# Altium project TempGuard.PrjPcb (part 1 of 2)
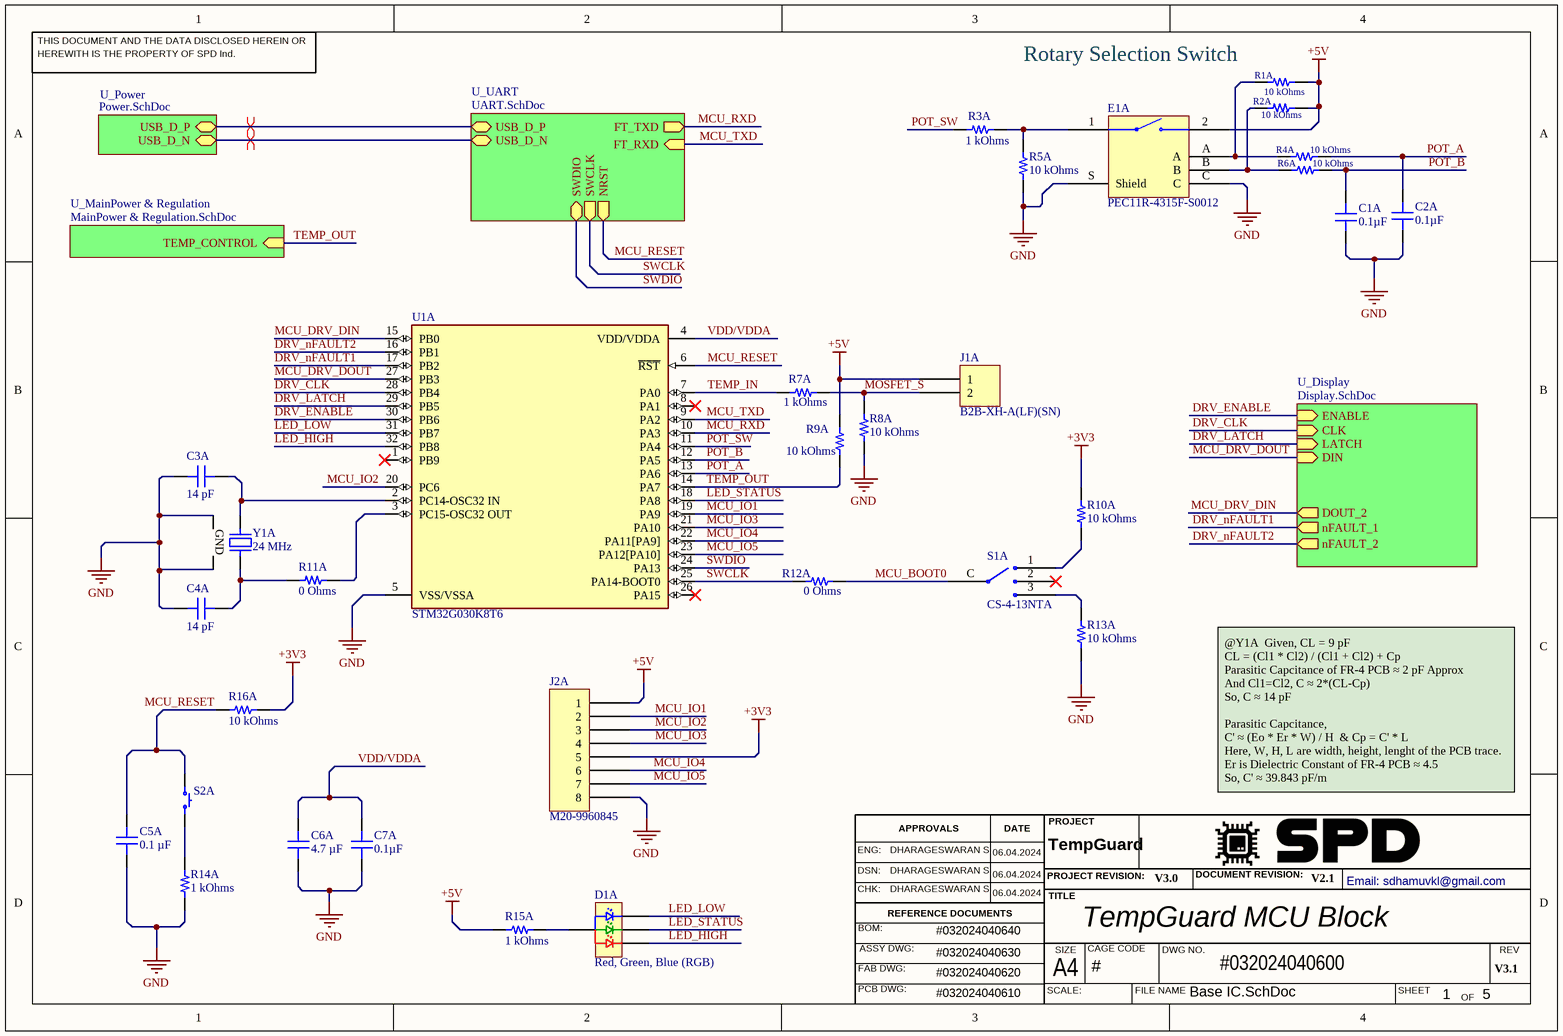
[diagram p0: Base IC.SchDoc]
CAGE_CODE: #; Date: 06.04.2024; DOC_NO_ASSY_DWG: #032024040630; DOC_NO_BOM: #032024040640; DOC_NO_FAB_DWG: #032024040620; DOC_NO_SCH_DWG: #032024040600; DocumentRevision: V2.1; PCB_DWG_NO: #032024040610; Project: TempGuard; ProjectRevision: V3.0; Revision: V3.1
5 sheets, 119 parts. Net scope: hierarchical (ports join the sheet entries above them; power ports are global).
Board file: TempGuard.PcbDoc
Sheets:
  Base IC.SchDoc
    U_Power = Power.SchDoc
    U_UART = UART.SchDoc
    U_Display = Display.SchDoc
    U_MainPower & Regulation = MainPower & Regulation.SchDoc

## Sheet Base IC.SchDoc: TempGuard MCU Block
size A4; SheetNumber: 1; SheetTotal: 5

### Parts
C1A  0.1µF  [CAP 0402_1005]
C2A  0.1µF  [CAP 0402_1005]
C3A  14 pF  [CAP 0402_1005]
C4A  14 pF  [CAP 0402_1005]
C5A  0.1 µF  [CAP 0402_1005]
C6A  4.7 µF  [CAP 0402_1005]
C7A  0.1µF  [CAP 0402_1005]
D1A  Red, Green, Blue (RGB)  [Harvatek B38G3RGB-10D0003H2U1930]
E1A  PEC11R-4315F-S0012  [BOURNS PEC11R-4315F-S0012]
J1A  B2B-XH-A(LF)(SN)  [JST XH B2B-XH-A]
J2A  M20-9960845  [HARWIN M20-9960845]
R1A  10 kOhms  [RES 0402_1005]
R2A  10 kOhms  [RES 0402_1005]
R3A  1 kOhms  [RES 0402_1005]
R4A  10 kOhms  [RES 0402_1005]
R5A  10 kOhms  [RES 0402_1005]
R6A  10 kOhms  [RES 0402_1005]
R7A  1 kOhms  [RES 0402_1005]
R8A  10 kOhms  [RES 0603_1608]
R9A  10 kOhms  [RES 0603_1608]
R10A  10 kOhms  [RES 0402_1005]
R11A  0 Ohms  [RES 0402_1005]
R12A  0 Ohms  [RES 0402_1005]
R13A  10 kOhms  [RES 0402_1005]
R14A  1 kOhms  [RES 0402_1005]
R15A  1 kOhms  [RES 0603_1608]
R16A  10 kOhms  [RES 0402_1005]
S1A  CS-4-13NTA  [NIDEC COPAL CS-4-13NTA]
S2A  EVP-AWED4A  [PANASONIC EVPAW]  (value not drawn)
U1A  STM32G030K8T6  [FP-LQFP32-5V-IPC_A]
Y1A  24 MHz  [EPSON TSX-3225]

### Sub-sheets
U_Display = Display.SchDoc: CLK (in), LATCH (in), DIN (in), DOUT_2 (out), nFAULT_1 (out), nFAULT_2 (out), ENABLE (in)
U_MainPower & Regulation = MainPower & Regulation.SchDoc: TEMP_CONTROL (in)
U_Power = Power.SchDoc: USB_D_N (bidir), USB_D_P (bidir)
U_UART = UART.SchDoc: USB_D_P (bidir), USB_D_N (bidir), SWDIO (bidir), SWCLK (out), NRST (out), FT_TXD (out), FT_RXD (in)

### Nets
+3V3: J2A.5 R10A.2 R16A.1
+5V: E1A.2 J1A.1 J2A.1 R1A.2 R2A.2 R9A.2 R15A.1
GND: C1A.1 C2A.1 C3A.1 C4A.1 C5A.1 C6A.1 C7A.1 E1A.C E1A.S(Shield) J2A.8 R5A.1 R8A.1 R13A.1 R14A.1 U1A.5(VSS/VSSA) Y1A.2(GND) Y1A.4(GND)
DRV_CLK: U1A.28(PB4) ; sheet U_Display/CLK  [project net CLK]
DRV_ENABLE: U1A.30(PB6) ; sheet U_Display/ENABLE
DRV_LATCH: U1A.29(PB5) ; sheet U_Display/LATCH
DRV_nFAULT1: U1A.17(PB2) ; sheet U_Display/nFAULT_1
DRV_nFAULT2: U1A.16(PB1) ; sheet U_Display/nFAULT_2
LED_HIGH: D1A.4(RED) U1A.32(PB8)
LED_LOW: D1A.2(BLUE) U1A.31(PB7)
LED_STATUS: D1A.1(GREEN) U1A.18(PA8)
MCU_BOOT0: R12A.2 S1A.C
MCU_DRV_DIN: U1A.15(PB0) ; sheet U_Display/DOUT_2  [project net DOUT_2]
MCU_DRV_DOUT: U1A.27(PB3) ; sheet U_Display/DIN  [project net DIN]
MCU_IO1: J2A.2 U1A.19(PA9)
MCU_IO2: J2A.3 U1A.20(PC6)
MCU_IO3: J2A.4 U1A.21(PA10)
MCU_IO4: J2A.6 U1A.22(PA11[PA9])
MCU_IO5: J2A.7 U1A.23(PA12[PA10])
MCU_RESET: C5A.2 R16A.2 S2A.1 U1A.6(~{RST}) ; sheet U_UART/NRST
MCU_RXD: U1A.10(PA3) ; sheet U_UART/FT_TXD
MCU_TXD: U1A.9(PA2) ; sheet U_UART/FT_RXD
MOSFET_S: J1A.2 R7A.1 R8A.2
POT_A: C2A.2 R4A.1 U1A.13(PA6)
POT_B: C1A.2 R6A.1 U1A.12(PA5)
POT_SW: R3A.2 U1A.11(PA4)
SWCLK: R12A.1 U1A.25(PA14-BOOT0) ; sheet U_UART/SWCLK
SWDIO: U1A.24(PA13) ; sheet U_UART/SWDIO
TEMP_IN: R7A.2 U1A.7(PA0)
TEMP_OUT: R9A.1 U1A.14(PA7) ; sheet U_MainPower & Regulation/TEMP_CONTROL
TVS_D_N: sheet U_Power/USB_D_N, sheet U_UART/USB_D_N
TVS_D_P: sheet U_Power/USB_D_P, sheet U_UART/USB_D_P
VDD/VDDA: C6A.2 C7A.2 U1A.4(VDD/VDDA)
NetC3A_2: C3A.2 U1A.2(PC14-OSC32_IN) Y1A.1
NetC4A_2: C4A.2 R11A.1 Y1A.3
NetD1A_3: D1A.3(ANODE) R15A.2
NetE1A_1: E1A.1 R3A.1 R5A.2
NetE1A_A: E1A.A R1A.1 R4A.2
NetE1A_B: E1A.B R2A.1 R6A.2
NetR10A_1: R10A.1 S1A.1
NetR11A_2: R11A.2 U1A.3(PC15-OSC32_OUT)
NetR13A_2: R13A.2 S1A.3
NetR14A_2: R14A.2 S2A.2

Not connected (* = marked no-connect by the designer): S1A 2*; U1A 1(PB9)* 8(PA1)* 26(PA15)*

### Layout directives
differential pair: TVS_D_N, TVS_D_P

### Notes on the sheet
- (near R1A) Rotary Selection Switch
- @Y1A  Given, CL = 9 pF
  CL = (Cl1 * Cl2) / (Cl1 + Cl2) + Cp
  Parasitic Capcitance of FR-4 PCB ≈ 2 pF Approx
  And Cl1=Cl2, C ≈ 2*(CL-Cp)
  So, C ≈ 14 pF
  Parasitic Capcitance,
  C' ≈ (Eo * Er * W) / H  & Cp = C' * L
  Here, W, H, L are width, height, lenght of the PCB trace.
  Er is Dielectric Constant of FR-4 PCB ≈ 4.5
  So, C' ≈ 39.843 pF/m
- THIS DOCUMENT AND THE DATA DISCLOSED HEREIN OR
- HEREWITH IS THE PROPERTY OF SPD Ind.
- ENG:
- DHARAGESWARAN S
- APPROVALS
- DATE
- PROJECT
- DSN:
- CHK:
- REFERENCE DOCUMENTS
- PROJECT REVISION:
- TITLE
- DOCUMENT REVISION:
- Email: sdhamuvkl@gmail.com <https://github.com/DhamuVkl>
- BOM:
- FAB DWG:
- PCB DWG:
- ASSY DWG:
- SCALE:
- A4
- SIZE
- CAGE CODE
- FILE NAME
- DWG NO.
- SHEET
- REV
- OF

### Library data of the parts
C1A C2A C7A = LD02ZD104KAB2A: CAP CER 0.1UF 10V X5R 0402; Manufacturer: AVX Corporation; id: 74; Tolerance: ±10%; Part Number: LD02ZD104KAB2A; Value: 0.1µF; Temperature Coefficient: X5R; Supplier Part Number 1: 478-4926-1-ND; ComponentLink2Description: DigiKey Link; ComponentLink1URL: http://datasheets.avx.com/LD-Series.pdf; PartId: 1811; Supplier 1: DigiKey; Series: LD; LastUpdated: 2022-02-08T12:26:58.257; Part Status: Active; Capacitance: 0.1µF; Device Package: 0402 (1005 Metric); Thickness (Max): 0.022" (0.56mm); Voltage - Rated: 10V; Minimum Order: 1; Packaging: TapeAndReel; Applications: General Purpose; Package / Case: 0402 (1005 Metric); ComponentLink1Description: Datasheet; Price: 0.20; ComponentLink2URL: http://digikey.com/product-detail/en/avx-corporation/LD02ZD104KAB2A/478-4926-1-ND/1858872; Lifecycle Status: Active; Operating Temperature: -55°C ~ 85°C; Size / Dimension: 0.039" L x 0.020" W (1.00mm x 0.50mm); Mounting Type: Surface Mount, MLCC
C3A C4A = GJM1555C1H140FB01D: CAP CER 14PF 50V C0G/NP0 0402; Manufacturer: Murata Electronics; id: 3682; Temperature Coefficient: C0G, NP0; Tolerance: ±1%; Part Number: GJM1555C1H140FB01D; Value: 14 pF; Supplier Part Number 1: 490-GJM1555C1H140FB01DCT-ND; ComponentLink2Description: DigiKey Link; Features: High Q, Low Loss; ComponentLink1URL: https://search.murata.co.jp/Ceramy/image/img/A01X/G101/ENG/GJM1555C1H140FB01-01.pdf; PartId: 32632; Supplier 1: DigiKey; Series: GJM; LastUpdated: 2023-01-03T20:03:29.740; Part Status: Active; Capacitance: 14 pF; Device Package: 0402 (1005 Metric); Thickness (Max): 0.022" (0.55mm); Voltage - Rated: 50V; Minimum Order: 1; Packaging: TapeAndReel; Applications: RF, Microwave, High Frequency; Package / Case: 0402 (1005 Metric); ComponentLink1Description: Datasheet; Price: 0.02; ComponentLink2URL: https://www.digikey.com/en/products/detail/murata-electronics/GJM1555C1H140FB01D/13401807; Lifecycle Status: Active; Operating Temperature: -55°C ~ 125°C; Size / Dimension: 0.039" L x 0.020" W (1.00mm x 0.50mm); Mounting Type: Surface Mount, MLCC
C5A = CL05B104KP5VPNC: CAP CER 100NF 10V X7R 0402; Manufacturer: Samsung Electro-Mechanics; id: 7736; Tolerance: ±10%; Part Number: CL05B104KP5VPNC; Value: 0.1 µF; Temperature Coefficient: X7R; Supplier Part Number 1: 1276-CL05B104KP5VPNCCT-ND; ComponentLink2Description: DigiKey Link; ComponentLink1URL: https://mm.digikey.com/Volume0/opasdata/d220001/medias/docus/5458/CL05B104KP5VPNC_Spec.pdf; PartId: 56690; Supplier 1: DigiKey; Series: CL; LastUpdated: 2023-11-05T20:02:55.743; Capacitance: 0.1 µF; Device Package: 0402 (1005 Metric); Ratings: AEC-Q200; Thickness (Max): 0.022" (0.55mm); Voltage - Rated: 10V; Minimum Order: 1; Packaging: TapeAndReel; Applications: Automotive; Package / Case: 0402 (1005 Metric); ComponentLink1Description: Datasheet; Price: 0.01; ComponentLink2URL: https://www.digikey.com/en/products/detail/samsung-electro-mechanics/CL05B104KP5VPNC/20498482; Lifecycle Status: Active; Operating Temperature: -55°C ~ 125°C; Size / Dimension: 0.039" L x 0.020" W (1.00mm x 0.50mm); Mounting Type: Surface Mount, MLCC
C6A = GRM155D81A475ME15D: CAP CER 4.7UF 10V X6T 0402; Manufacturer: Murata Electronics; id: 6096; Tolerance: ±20%; Part Number: GRM155D81A475ME15D; Value: 4.7 µF; Temperature Coefficient: X6T; Supplier Part Number 1: 490-GRM155D81A475ME15DCT-ND; ComponentLink2Description: DigiKey Link; ComponentLink1URL: https://search.murata.co.jp/Ceramy/image/img/A01X/G101/ENG/GRM155D81A475ME15-01A.pdf; PartId: 47525; Supplier 1: DigiKey; Series: GRM; LastUpdated: 2023-02-23T20:03:07.920; Part Status: Active; Capacitance: 4.7 µF; Device Package: 0402 (1005 Metric); Thickness (Max): 0.028" (0.70mm); Voltage - Rated: 10V; Minimum Order: 1; Packaging: TapeAndReel; Applications: General Purpose; Package / Case: 0402 (1005 Metric); ComponentLink1Description: Datasheet; Price: 0.03; ComponentLink2URL: https://www.digikey.com/en/products/detail/murata-electronics/GRM155D81A475ME15D/16821302; Lifecycle Status: Active; Operating Temperature: -55°C ~ 105°C; Size / Dimension: 0.039" L x 0.020" W (1.00mm x 0.50mm); Mounting Type: Surface Mount, MLCC
D1A = B38G3RGB-10D0003H2U1930: LED RGB MIXED WHITE ( 1.6(L)X1.6; Manufacturer: Harvatek Corporation; id: 1399; Lens Style: Rectangle with Flat Top; Lens Size: 1.60mm x 1.10mm; Configuration: Common Anode; Voltage - Forward (Vf) (Typ): 2V Red, 3V Green, 3V Blue; Current - Test: 10mA Red, 10mA Green, 10mA Blue; Millicandela Rating: 630mcd Red, 630mcd Green, 630mcd Blue; Part Number: B38G3RGB-10D0003H2U1930; Supplier Part Number 1: 3147-B38G3RGB-10D0003H2U1930CT-ND; Supplier Device Package: 0606; ComponentLink1Description: Datasheet; Color: Red, Green, Blue (RGB); ComponentLink2URL: https://www.digikey.com/en/products/detail/harvatek-corporation/B38G3RGB-10D0003H2U1930/13588733; ComponentLink1URL: https://media.digikey.com/pdf/Data%20Sheets/Harvatek%20PDFs/B38G3RGB-10D0003H2U1930%20%20V1.9.pdf; Supplier 1: DigiKey; Series: -; Height (Max): 0.50mm; Part Status: Active; ComponentLink2Description: DigiKey Link; Packaging: TapeAndReel; Minimum Order: 1; PartId: 1416; Lifecycle Status: Active; LastUpdated: 2023-10-31T16:54:14.060; Value: Red, Green, Blue (RGB); Size / Dimension: 1.60mm L x 1.60mm W; Mounting Type: Surface Mount; Price: 0.11
E1A = PEC11R-4315F-S0012: ROTARY ENCODER MECHANICAL 12PPR; Manufacturer 1: Bourns; Manufacturer: Bourns Inc.; Output Type: Quadrature (Incremental); Built in Switch: Yes; Number of Channels: 2; Pulses per Revolution: 12; Capacitance: 4315F; id: 3; Actuator Type: 6mm Dia Flatted End; Rotational Life (Cycles Min): 30K; Supplier 1: DigiKey; Manufacturer Part Number 1: PEC11R-4315F-S0012; Stock 1: 453; Pricing 1: 1=1.91000, 10=1.68200, 25=1.50800, 50=1.45000, 100=1.39200, 250=1.33400, 500=1.10200, 1000=1.04400, 5000=0.87000 (USD); RoHS: Yes; Mount: Through Hole,Panel,PCB; Min Operating Temperature: -30°C; Max Operating Temperature: 70°C; Termination: PC Pin; Packaging: Unknown; Package Quantity: 75; Encoder Type: Mechanical; Detent: Yes; Orientation: Vertical; Length: 21.5mm; Height: 13.4mm; Width: 12.5mm; ComponentLink1URL: https://www.bourns.com/docs/Product-Datasheets/PEC11R.pdf; ComponentLink1Description: Datasheet; ComponentLink2URL: http://digikey.com/product-detail/en/bourns-inc/PEC11R-4315F-S0012/PEC11R-4315F-S0012-ND/4699232; ComponentLink2Description: DigiKey Link; Part Number: PEC11R-4315F-S0012; Supplier Part Number 1: PEC11R-4315F-S0012-ND; Series: PEC11R; Part Status: Active; Minimum Order: 1; Lifecycle Status: Active; LastUpdated: 2020-06-25T15:43:11.617; Termination Style: PC Pin; Mounting Type: Panel, PCB Through Hole; Price: 1.91
J1A = B2B-XH-A(LF)(SN): CONN HEADER VERT 2POS 2.5MM; Manufacturer: JST Sales America Inc.; id: 67; Style: Board to Cable/Wire; Current Rating (Amps): 3A; Pitch - Mating: 0.098" (2.50mm); Number Of Positions: 2; Number Of Positions Loaded: All; Voltage Rating: 250V; Shrouding: Shrouded - 4 Wall; Material Flammability Rating: UL94 V-0; Contact Length - Post: 0.134" (3.40mm); Part Number: B2B-XH-A(LF)(SN); Supplier Part Number 1: 455-2247-ND; Contact Shape: Square; Termination: Press-Fit, Solder; ComponentLink1Description: Datasheet; Connector Type: Header; Contact Material: Brass; ComponentLink2URL: http://digikey.com/product-detail/en/jst-sales-america-inc/B2B-XH-A-LF-SN/455-2247-ND/1651045; Contact Finish - Mating: Tin; ComponentLink1URL: http://www.jst-mfg.com/product/pdf/eng/eXH.pdf; Fastening Type: Detent Lock; Supplier 1: DigiKey; Number Of Rows: 1; Series: XH; Part Status: Active; ComponentLink2Description: DigiKey Link; Contact Type: Male Pin; Packaging: Bulk; Insulation Height: 0.276" (7.00mm); Contact Finish - Post: Tin; Minimum Order: 1; PartId: 67; Lifecycle Status: Active; LastUpdated: 2020-01-12T23:46:07.593; Operating Temperature: -25°C ~ 85°C; Insulation Color: Natural; Mounting Type: Through Hole; Insulation Material: Polyamide (PA66), Nylon 6/6; Price: 0.15
J2A = M20-9960845: CONN HEADER R/A 8POS 2.54MM; Manufacturer: Harwin Inc.; id: 171; Style: Board to Board or Cable; Current Rating (Amps): 3A per Contact; Contact Length - Mating: 0.240" (6.10mm); Connector Type: Header, Cuttable; Pitch - Mating: 0.100" (2.54mm); Number Of Positions: 8; Number Of Positions Loaded: All; Shrouding: Unshrouded; Material Flammability Rating: UL94 V-0; Row Spacing - Mating: -40°C ~ 105°C; Contact Length - Post: 0.118" (3.00mm); Part Number: M20-9960845; Supplier Part Number 1: 952-2249-ND; Contact Shape: Square; Termination: Solder; ComponentLink1Description: Datasheet; Contact Material: Brass; ComponentLink2URL: https://www.digikey.com/en/products/detail/harwin-inc/M20-9960845/3728213; Contact Finish - Mating: Gold; ComponentLink1URL: https://cdn.harwin.com/pdfs/Harwin_PC_Connectors_M20.pdf; Fastening Type: Push-Pull; Supplier 1: DigiKey; Number Of Rows: 1; Series: M20; Part Status: Active; ComponentLink2Description: DigiKey Link; Contact Type: Male Pin; Packaging: Bulk; Insulation Height: 0.100" (2.54mm); Minimum Order: 1; PartId: 171; Lifecycle Status: Active; LastUpdated: 2022-09-21T19:24:16.033; Operating Temperature: -40°C ~ 105°C; Insulation Color: Black; Mounting Type: Through Hole, Right Angle; Insulation Material: Polyamide (PA6T), Nylon 6T; Price: 0.20
R1A R2A R4A R5A R6A R10A R13A R16A = AA0402FR-0710KL: RES SMD 10K OHM 1% 1/16W 0402; Manufacturer: Yageo; id: 10610; Temperature Coefficient: ±150ppm/°C; Power (Watts): 0.063W, 1/16W; Part Number: AA0402FR-0710KL; Height - Seated (Max): 0.015" (0.37mm); Supplier Part Number 1: 13-AA0402FR-0710KLCT-ND; Supplier Device Package: 0402; ComponentLink1Description: Datasheet; ComponentLink2URL: https://www.digikey.com/en/products/detail/yageo/AA0402FR-0710KL/5887729; Features: Anti-Sulfur, Automotive AEC-Q200, Moisture Resistant; ComponentLink1URL: https://www.yageo.com/upload/media/product/productsearch/datasheet/rchip/PYu-AA_51_RoHS_L_3.pdf; Composition: Thick Film; Tolerance: ±1%; Supplier 1: DigiKey; Series: AA; Part Status: Active; ComponentLink2Description: DigiKey Link; Device Package: 0402 (1005 Metric); Packaging: TapeAndReel; Ratings: AEC-Q200; Minimum Order: 1; Package / Case: 0402 (1005 Metric); PartId: 59190; Lifecycle Status: Active; LastUpdated: 2023-01-02T20:20:10.303; Operating Temperature: -55°C ~ 155°C; Number Of Terminations: 2; Value: 10 kOhms; Size / Dimension: 0.039" L x 0.020" W (1.00mm x 0.50mm); Price: 0.01; Resistance: 10 kOhms
R3A R7A R14A = AA0402FR-071KL: RES SMD 1K OHM 1% 1/16W 0402; Manufacturer: Yageo; id: 10598; Temperature Coefficient: ±150ppm/°C; Power (Watts): 0.063W, 1/16W; Part Number: AA0402FR-071KL; Height - Seated (Max): 0.015" (0.37mm); Supplier Part Number 1: 13-AA0402FR-071KLCT-ND; Supplier Device Package: 0402; ComponentLink1Description: Datasheet; ComponentLink2URL: https://www.digikey.com/en/products/detail/yageo/AA0402FR-071KL/5887878; Features: Anti-Sulfur, Automotive AEC-Q200, Moisture Resistant; ComponentLink1URL: https://www.yageo.com/upload/media/product/productsearch/datasheet/rchip/PYu-AA_51_RoHS_L_3.pdf; Composition: Thick Film; Tolerance: ±1%; Supplier 1: DigiKey; Series: AA; Part Status: Active; ComponentLink2Description: DigiKey Link; Device Package: 0402 (1005 Metric); Packaging: TapeAndReel; Ratings: AEC-Q200; Minimum Order: 1; Package / Case: 0402 (1005 Metric); PartId: 59178; Lifecycle Status: Active; LastUpdated: 2023-01-02T20:20:10.210; Operating Temperature: -55°C ~ 155°C; Number Of Terminations: 2; Value: 1 kOhms; Size / Dimension: 0.039" L x 0.020" W (1.00mm x 0.50mm); Price: 0.01; Resistance: 1 kOhms
R8A R9A = ERA-3AEB103V: RES SMD 10K OHM 0.1% 1/10W 0603; Manufacturer: Panasonic Electronic Components; id: 300; Temperature Coefficient: ±25ppm/°C; Power (Watts): 0.1W, 1/10W; Part Number: ERA-3AEB103V; Height - Seated (Max): 0.022" (0.55mm); Supplier Part Number 1: P10KDBCT-ND; Supplier Device Package: 0603; ComponentLink1Description: Datasheet; ComponentLink2URL: https://www.digikey.com/en/products/detail/panasonic-electronic-components/ERA-3AEB103V/1465878; Features: Automotive AEC-Q200; ComponentLink1URL: https://industrial.panasonic.com/cdbs/www-data/pdf/RDM0000/AOA0000C307.pdf; Composition: Thin Film; Tolerance: ±0.1%; Supplier 1: DigiKey; Series: ERA-3A; Part Status: Active; ComponentLink2Description: DigiKey Link; Device Package: 0603 (1608 Metric); Packaging: TapeAndReel; Ratings: AEC-Q200; Minimum Order: 1; Package / Case: 0603 (1608 Metric); PartId: 5506; Lifecycle Status: Active; LastUpdated: 2023-01-02T20:30:24.503; Operating Temperature: -55°C ~ 155°C; Number Of Terminations: 2; Value: 10 kOhms; Size / Dimension: 0.063" L x 0.031" W (1.60mm x 0.80mm); Price: 0.03; Resistance: 10 kOhms
R11A R12A = AC0402JR-070RL: RES SMD 0 OHM JUMPER 1/16W 0402; Manufacturer: Yageo; id: 9339; Power (Watts): 0.063W, 1/16W; Part Number: AC0402JR-070RL; Height - Seated (Max): 0.015" (0.37mm); Supplier Part Number 1: 311-0.0LBCT-ND; Supplier Device Package: 0402; ComponentLink1Description: Datasheet; ComponentLink2URL: https://www.digikey.com/en/products/detail/yageo/AC0402JR-070RL/2827807; Features: Automotive AEC-Q200, Moisture Resistant; ComponentLink1URL: https://www.yageo.com/upload/media/product/productsearch/datasheet/rchip/PYu-AC_51_RoHS_L_7.pdf; Composition: Thick Film; Tolerance: Jumper; Supplier 1: DigiKey; Series: AC; Part Status: Active; ComponentLink2Description: DigiKey Link; Device Package: 0402 (1005 Metric); Packaging: CutTape; Ratings: AEC-Q200; Minimum Order: 1; Package / Case: 0402 (1005 Metric); PartId: 20617; Lifecycle Status: Active; LastUpdated: 2023-01-02T20:20:32.243; Operating Temperature: -55°C ~ 155°C; Number Of Terminations: 2; Value: 0 Ohms; Size / Dimension: 0.039" L x 0.020" W (1.00mm x 0.50mm); Price: 0.01; Resistance: 0 Ohms
R15A = RMCF0603JT1K00: RES 1K OHM 5% 1/10W 0603; Manufacturer: Stackpole Electronics Inc; id: 454; Temperature Coefficient: ±200ppm/°C; Power (Watts): 0.1W, 1/10W; Part Number: RMCF0603JT1K00; Height - Seated (Max): 0.022" (0.55mm); Supplier Part Number 1: RMCF0603JT1K00CT-ND; Supplier Device Package: 0603; ComponentLink1Description: Datasheet; ComponentLink2URL: https://www.digikey.com/en/products/detail/stackpole-electronics-inc/RMCF0603JT1K00/1758057; Features: Automotive AEC-Q200; ComponentLink1URL: https://www.seielect.com/catalog/sei-rmcf_rmcp.pdf; Composition: Thick Film; Tolerance: ±5%; Supplier 1: DigiKey; Series: RMCF; Part Status: Active; ComponentLink2Description: DigiKey Link; Device Package: 0603 (1608 Metric); Packaging: CutTape; Ratings: AEC-Q200; Minimum Order: 1; Package / Case: 0603 (1608 Metric); PartId: 5824; Lifecycle Status: Active; LastUpdated: 2023-01-02T20:30:23.167; Operating Temperature: -55°C ~ 155°C; Number Of Terminations: 2; Value: 1 kOhms; Size / Dimension: 0.061" L x 0.031" W (1.55mm x 0.80mm); Price: 0.01; Resistance: 1 kOhms
S1A = CS-4-13NTA: SWITCH ROTARY DIP SP3T 100MA 16V; Manufacturer: Nidec Copal Electronics; id: 6; Actuator Level: Flush, Recessed; Number Of Positions: 3; Washable: Yes; Pitch: 0.051" (1.30mm); Actuator Type: Rotary for Tool; Part Number: CS-4-13NTA; Height Above Board: 0.091" (2.30mm); Supplier Part Number 1: 563-1035-1-ND; Current Rating (Amps): 100mA; ComponentLink1Description: Datasheet; Contact Material: Copper Alloy; ComponentLink2URL: https://www.digikey.com/en/products/detail/nidec-copal-electronics/CS-4-13NTA/948346; ComponentLink1URL: https://www.nidec-copal-electronics.com/e/catalog/switch/cs-4.pdf; Supplier 1: DigiKey; Series: CS-4; Part Status: Active; ComponentLink2Description: DigiKey Link; Packaging: TapeAndReel; Minimum Order: 1; Contact Finish: Gold; PartId: 13; Lifecycle Status: Active; LastUpdated: 2022-09-26T03:19:43.077; Termination Style: J Lead; Operating Temperature: -25°C ~ 70°C; Circuit: SP3T; Mounting Type: Surface Mount; Price: 0.93
S2A = EVP-AWED4A: 3.0MM X 2.0MM / 3.3N / 0.15MM ST; Manufacturer: Panasonic Electronic Components; id: 5; Switch Function: Off-Mom; Contact Rating @ Voltage: 0.02A @ 15VDC; Outline: 3.00mm x 2.00mm; Actuator Height Off Pcb, Vertical: 0.60mm; Ingress Protection: IP67 - Dust Tight, Waterproof; Actuator Orientation: Top Actuated; Actuator Type: Standard; Illumination: Non-Illuminated; Operating Force: 330gf; Circuit: SPST-NO; Part Number: EVP-AWED4A; Supplier Part Number 1: P123440CT-ND; ComponentLink1Description: Datasheet; ComponentLink2URL: https://www.digikey.com/en/products/detail/panasonic-electronic-components/EVP-AWED4A/8568275; ComponentLink1URL: https://industrial.panasonic.com/ac/cdn/e/control/switch/light-touch/catalog/sw_lt_eng_3020s.pdf; Supplier 1: DigiKey; Series: EVPAW; Part Status: Active; ComponentLink2Description: DigiKey Link; Packaging: TapeAndReel; Minimum Order: 1; Lifecycle Status: Active; LastUpdated: 2023-01-02T21:07:29.980; Termination Style: SMD (SMT) Tab; Operating Temperature: -40°C ~ 85°C; Mounting Type: Surface Mount; Price: 0.16
U1A = CMP-12105-000136-1: IC MCU 32BIT 64KB FLASH 32LQFP; RoHS Compliant: Yes
Y1A = TSX-3225 24.0000MF15X-AC3: CRYSTAL 24.0000MHZ 9PF SMD; Manufacturer: EPSON; id: 441; Frequency Tolerance: ±10ppm; Frequency Stability: ±15ppm; Operating Mode: Fundamental; Esr (Equivalent Series Resistance): 40 Ohms; Part Number: TSX-3225 24.0000MF15X-AC3; Height - Seated (Max): 0.024" (0.60mm); Supplier Part Number 1: SER3635CT-ND; ComponentLink1Description: Datasheet; ComponentLink2URL: https://www.digikey.com/en/products/detail/epson/TSX-3225-24-0000MF15X-AC3/1825444; ComponentLink1URL: https://support.epson.biz/td/api/doc_check.php?dl=brief_TSX-3225&lang=en; Supplier 1: DigiKey; Frequency: 24 MHz; Series: TSX-3225; Part Status: Active; Type: MHz Crystal; ComponentLink2Description: DigiKey Link; Packaging: TapeAndReel; Minimum Order: 1; Package / Case: 4-SMD, No Lead; PartId: 441; Lifecycle Status: Active; LastUpdated: 2023-01-02T20:58:19.840; Operating Temperature: -40°C ~ 85°C; Value: 24 MHz; Size / Dimension: 0.126" L x 0.098" W (3.20mm x 2.50mm); Mounting Type: Surface Mount; Price: 0.44; Load Capacitance: 9pF

## Sheet Power.SchDoc: POWER MANAGEMENT
size A4; SheetNumber: 4; SheetTotal: 5; DOC_NO_SCH_DWG: #032024040603
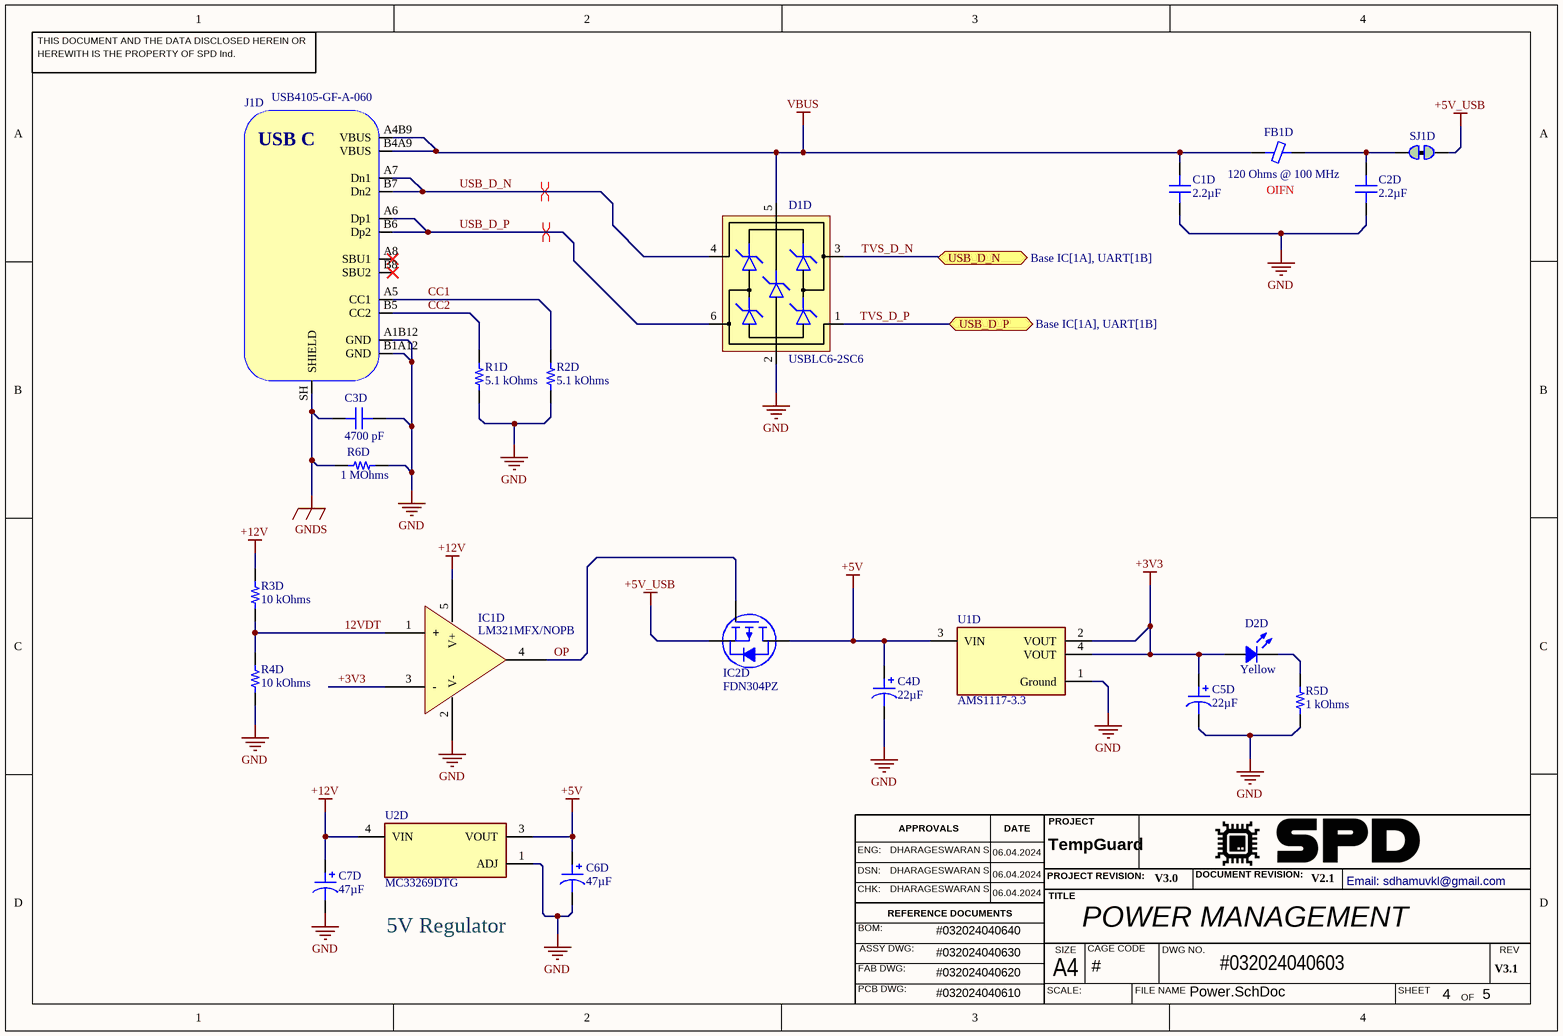
[diagram p1: Power.SchDoc]

### Parts
C1D  2.2µF  [CAP 0402_1005]
C2D  2.2µF  [CAP 0402_1005]
C3D  4700 pF  [CAP 0402_1005]
C4D  22µF  [CAP POL 1411_3528]
C5D  22µF  [CAP POL 1411_3528]
C6D  47µF  [CAP ALSMD 6.6MM H5.4MM]
C7D  47µF  [CAP ALSMD 6.6MM H5.4MM]
D1D  USBLC6-2SC6  [SOT-23-6]
D2D  Yellow  [LED 0402_1005 YELLOW]
FB1D  120 Ohms @ 100 MHz  [FER 0603_1608]
IC1D  LM321MFX/NOPB  [TI SOT-23-5 DBV]
IC2D  FDN304PZ  [ON SEMI SOT-23-3]
J1D  USB4105-GF-A-060  [USB4105-GF-A-060]
R1D  5.1 kOhms  [RES 0402_1005]
R2D  5.1 kOhms  [RES 0402_1005]
R3D  10 kOhms  [RES 0402_1005]
R4D  10 kOhms  [RES 0402_1005]
R5D  1 kOhms  [RES 0402_1005]
R6D  1 MOhms  [RES 0402_1005]
SJ1D  2PIN  [Rounded Jumper Joint]  (value not drawn)
U1D  AMS1117-3.3  [FP-AMS1117-IPC_C]
U2D  MC33269DTG  [FP-369C-MFG]

### Ports
USB_D_N (bidir, see Base IC[1A], UART[1B]), USB_D_P (bidir, see Base IC[1A], UART[1B])

### Nets
+3V3: C5D.1 D2D.1 IC1D.3(-) U1D.2(VOUT) U1D.4(VOUT)
+5V: C4D.1 C6D.1 IC2D.3(D) U1D.3(VIN) U2D.3(VOUT)
+5V_USB: IC2D.2(S) SJ1D.2
+12V: C7D.1 IC1D.5(V+) R3D.2 U2D.4(VIN)
GND: C1D.1 C2D.1 C3D.2 C4D.2 C5D.2 C6D.2 C7D.2 D1D.2(GND) IC1D.2(V-) J1D.A1B12(GND) J1D.B1A12(GND) R1D.1 R2D.1 R4D.1 R5D.1 R6D.2 U1D.1(Ground) U2D.1(ADJ)
GNDS: C3D.1 J1D.SH(SHIELD) R6D.1
VBUS: C1D.2 D1D.5(VBUS) FB1D.1 J1D.A4B9(VBUS) J1D.B4A9(VBUS)
12VDT: IC1D.1(+) R3D.1 R4D.2
CC1: J1D.A5(CC1) R2D.2
CC2: J1D.B5(CC2) R1D.2
OP: IC1D.4(OUT) IC2D.1(G)
TVS_D_N: D1D.3(IO2) ; port USB_D_N
TVS_D_P: D1D.1(IO1) ; port USB_D_P
USB_D_N: D1D.4(IO2) J1D.A7(Dn1) J1D.B7(Dn2)
USB_D_P: D1D.6(IO1) J1D.A6(Dp1) J1D.B6(Dp2)
NetC2D_2: C2D.2 FB1D.2 SJ1D.1
NetD2D_2: D2D.2 R5D.2

Not connected (* = marked no-connect by the designer): J1D A8(SBU1)* B8(SBU2)*

### Layout directives
differential pair: USB_D_N, USB_D_P

### Notes on the sheet
- (near FB1D) OIFN
- 5V Regulator
- THIS DOCUMENT AND THE DATA DISCLOSED HEREIN OR
- HEREWITH IS THE PROPERTY OF SPD Ind.
- ENG:
- DHARAGESWARAN S
- APPROVALS
- DATE
- PROJECT
- DSN:
- CHK:
- REFERENCE DOCUMENTS
- PROJECT REVISION:
- TITLE
- DOCUMENT REVISION:
- Email: sdhamuvkl@gmail.com <https://github.com/DhamuVkl>
- BOM:
- FAB DWG:
- PCB DWG:
- ASSY DWG:
- SCALE:
- A4
- SIZE
- CAGE CODE
- FILE NAME
- DWG NO.
- SHEET
- REV
- OF
- (in symbol USB4105-GF-A-060) USB C

### Library data of the parts
C1D C2D = 0402ZD225KAT2A: CAP CER 2.2UF 10V X5R 0402; Manufacturer: AVX Corporation; id: 2335; Tolerance: ±10%; Part Number: 0402ZD225KAT2A; Value: 2.2µF; Temperature Coefficient: X5R; Supplier Part Number 1: 478-10072-1-ND; ComponentLink2Description: DigiKey Link; ComponentLink1URL: http://datasheets.avx.com/cx5r.pdf; PartId: 9346; Supplier 1: DigiKey; Series: -; LastUpdated: 2022-02-08T12:26:45.707; Part Status: Active; Capacitance: 2.2µF; Device Package: 0402 (1005 Metric); Thickness (Max): 0.022" (0.56mm); Voltage - Rated: 10V; Minimum Order: 1; Packaging: TapeAndReel; Applications: General Purpose; Package / Case: 0402 (1005 Metric); ComponentLink1Description: Datasheet; Price: 0.09; ComponentLink2URL: http://digikey.com/product-detail/en/avx-corporation/0402ZD225KAT2A/478-10072-1-ND/6564294; Lifecycle Status: Active; Operating Temperature: -55°C ~ 85°C; Size / Dimension: 0.039" L x 0.020" W (1.00mm x 0.50mm); Mounting Type: Surface Mount, MLCC
C3D = C0402C472K4RECAUTO: CAP CER 0402 4.7NF 16V X7R 10%; Manufacturer: KEMET; id: 3032; Part Number: C0402C472K4RECAUTO; Value: 4700 pF; Temperature Coefficient: X7R; Supplier Part Number 1: 399-17875-1-ND; ComponentLink2Description: DigiKey Link; ComponentLink1URL: https://api.kemet.com/component-edge/download/datasheet/C0402C472K4RECAUTO.pdf; PartId: 12122; Tolerance: ±10%; Supplier 1: DigiKey; Series: ESD SMD Auto X7R; LastUpdated: 2023-01-03T20:03:46.940; Part Status: Active; Capacitance: 4700 pF; Device Package: 0402 (1005 Metric); Ratings: AEC-Q200; Thickness (Max): 0.022" (0.55mm); Voltage - Rated: 16V; Minimum Order: 1; Packaging: TapeAndReel; Applications: Automotive, ESD Protection; Package / Case: 0402 (1005 Metric); ComponentLink1Description: Datasheet; Price: 0.01; ComponentLink2URL: https://www.digikey.com/en/products/detail/kemet/C0402C472K4RECAUTO/8640469; Lifecycle Status: Active; Operating Temperature: -55°C ~ 125°C; Size / Dimension: 0.039" L x 0.020" W (1.00mm x 0.50mm); Mounting Type: Surface Mount, MLCC
C4D C5D = T540B226K010CH86107610: CAP TANT POLY 22UF 10V 1411; Manufacturer: KEMET; Manufacturer Size Code: B; id: 2514; Tolerance: ±10%; Type: Molded; Ratings: COTS; Lifetime @ Temp.: 2000 Hrs @ 125°C; Esr (Equivalent Series Resistance): 80mOhm @ 100kHz; Part Number: T540B226K010CH86107610; Value: 22µF; Height - Seated (Max): 0.083" (2.10mm); Supplier Part Number 1: T540B226K010CH86107610-ND; ComponentLink2Description: DigiKey Link; Features: High Reliability; ComponentLink1URL: https://api.kemet.com/component-edge/download/datasheet/T540B226K010CH86107610.pdf; PartId: 2514; Supplier 1: DigiKey; Series: KO-CAP® T540; LastUpdated: 2020-08-30T20:56:14.177; Capacitance: 22µF; Voltage - Rated: 10V; Minimum Order: 3600; Packaging: Bulk; Package / Case: 1411 (3528 Metric); ComponentLink1Description: Datasheet; Price: 9.10; ComponentLink2URL: http://digikey.com/product-detail/en/kemet/T540B226K010CH86107610/T540B226K010CH86107610-ND/6676110; Lifecycle Status: Active; Operating Temperature: -55°C ~ 125°C; Size / Dimension: 0.138" L x 0.110" W (3.50mm x 2.80mm); Mounting Type: Surface Mount
C6D C7D = EEE-HA1C470P: CAP ALUM 47UF 20% 16V SMD; Manufacturer: Panasonic Electronic Components; id: 1065; Ripple Current @ Low Frequency: 70mA @ 120Hz; Surface Mount Land Size: 0.260" L x 0.260" W (6.60mm x 6.60mm); Polarization: Polar; Lifetime @ Temp.: 1000 Hrs @ 105°C; Ripple Current @ High Frequency: 119mA @ 10kHz; Part Number: EEE-HA1C470P; Value: 47µF; Height - Seated (Max): 0.213" (5.40mm); Supplier Part Number 1: PCE4189CT-ND; ComponentLink2Description: DigiKey Link; ComponentLink1URL: https://industrial.panasonic.com/cdbs/www-data/pdf/RDE0000/ABA0000C1151.pdf; PartId: 8737; Tolerance: ±20%; Supplier 1: DigiKey; Series: HA; LastUpdated: 2020-09-02T01:18:32.593; Part Status: Active; Capacitance: 47µF; Device Package: Radial, Can - SMD; Ratings: AEC-Q200; Voltage - Rated: 16V; Minimum Order: 1; Packaging: TapeAndReel; Applications: Automotive; Package / Case: Radial, Can - SMD; ComponentLink1Description: Datasheet; Price: 0.08; ComponentLink2URL: http://digikey.com/product-detail/en/panasonic-electronic-components/EEE-HA1C470P/PCE4189CT-ND/814262; Lifecycle Status: Active; Operating Temperature: -40°C ~ 105°C; Size / Dimension: 0.248" Dia (6.30mm); Mounting Type: Surface Mount
D1D = USBLC6-2SC6: Low-Capacitance ESD Protection USB; Manufacturer: STMicroelectronics; Manufacturer Part Number: USBLC6-2SC6; Distributor Link: https://www.mouser.de/ProductDetail/STMicroelectronics/USBLC6-2SC6?qs=po45yt2pPpu%2FhNIlwQdTlg%3D%3D
D2D = SM0402YC: LED YELLOW CLEAR 0402 SMD; Manufacturer: Bivar Inc.; id: 170; Lens Color: Colorless; Wavelength - Peak: 593nm; Lens Style: Rectangle with Flat Top; Viewing Angle: 130°; Lens Size: 0.50mm x 1.00mm; Configuration: 0402; Wavelength - Dominant: 592nm; Voltage - Forward (Vf) (Typ): 2V; Current - Test: 20mA; Millicandela Rating: 145mcd; Part Number: SM0402YC; Supplier Part Number 1: 492-2206-1-ND; Lens Transparency: Clear; Supplier Device Package: 0402; ComponentLink1Description: Datasheet; Color: Yellow; ComponentLink2URL: https://www.digikey.com/en/products/detail/bivar-inc/SM0402YC/6810862; ComponentLink1URL: https://www.bivar.com/Files/Datasheets/SM0402YC.pdf; Supplier 1: DigiKey; Series: -; Height (Max): 0.71mm; Part Status: Active; ComponentLink2Description: DigiKey Link; Device Package: 0402 (1005 Metric); Packaging: TapeAndReel; Minimum Order: 1; Package / Case: 0402 (1005 Metric); PartId: 170; Lifecycle Status: Active; LastUpdated: 2023-01-02T20:57:30.187; Value: Yellow; Size / Dimension: 1.00mm L x 0.50mm W; Mounting Type: Surface Mount; Price: 0.16
FB1D = BLM18KG121TZ1D: FERRITE BEAD 120 OHM 0603 1LN; Manufacturer: Murata Electronics; id: 635; DC Resistance (DCR) (Max): 30mOhm; Number Of Lines: 1; Filter Type: Power Line; Current Rating (Max): 3A; Part Number: BLM18KG121TZ1D; Supplier Part Number 1: 490-16500-1-ND; ComponentLink1Description: Datasheet; ComponentLink2URL: https://www.digikey.com/en/products/detail/murata-electronics/BLM18KG121TZ1D/7363244; ComponentLink1URL: https://www.murata.com/en-us/products/productdata/8796750610462/QNFA9122.pdf; Supplier 1: DigiKey; Series: EMIFIL®, BLM18; Height (Max): 0.030" (0.75mm); Part Status: Active; ComponentLink2Description: DigiKey Link; Device Package: 0603 (1608 Metric); Impedance @ Frequency: 120 Ohms @ 100 MHz; Packaging: TapeAndReel; Ratings: AEC-Q200; Minimum Order: 1; Package / Case: 0603 (1608 Metric); PartId: 635; Lifecycle Status: Active; LastUpdated: 2023-01-02T20:51:43.247; Operating Temperature: -55°C ~ 125°C; Value: 120 Ohms @ 100 MHz; Size / Dimension: 0.063" L x 0.032" W (1.60mm x 0.80mm); Mounting Type: Surface Mount; Price: 0.02
IC1D = LM321MFX/NOPB: IC OPAMP GP 1 CIRCUIT SOT23-5; Manufacturer: Texas Instruments; id: 11; Voltage - Input Offset: 2mV; Slew Rate: 0.4V/µs; Number Of Circuits: 1; Current - Input Bias: 45nA; Gain Bandwidth Product: 1MHz; Amplifier Type: General Purpose; Current - Supply: 660µA; Voltage - Supply, Single/Dual (±): 3V ~ 30V, ±1.5V ~ 15V; Current - Output / Channel: 40mA; Part Number: LM321MFX/NOPB; Supplier Part Number 1: LM321MFX/NOPBCT-ND; Supplier Device Package: SOT-23-5; ComponentLink1Description: Datasheet; ComponentLink2URL: http://digikey.com/product-detail/en/texas-instruments/LM321MFX-NOPB/LM321MFX-NOPBCT-ND/3440175; ComponentLink1URL: http://www.ti.com/general/docs/suppproductinfo.tsp?distId=10&gotoUrl=http%3A%2F%2Fwww.ti.com%2Flit%2Fgpn%2Flm321; Supplier 1: DigiKey; Series: -; Part Status: Active; ComponentLink2Description: DigiKey Link; Device Package: SC-74A, SOT-753; Packaging: TapeAndReel; Minimum Order: 1; Package / Case: SC-74A, SOT-753; PartId: 11; Lifecycle Status: Active; LastUpdated: 2020-03-30T15:10:58.873; Operating Temperature: -40°C ~ 85°C; Mounting Type: Surface Mount; Price: 0.23
IC2D = FDN304PZ: MOSFET P-CH 20V 2.4A SSOT-3; Manufacturer: ON Semiconductor; id: 80; FET Type: P-Channel; Drive Voltage (Max Rds On,  Min Rds On): 1.8V, 4.5V; Power Dissipation (Max): 500mW (Ta); Vgs (Max): ±8V; Input Capacitance (Ciss) (Max) @ Vds: 1310pF @ 10V; Gate Charge (Qg) (Max) @ Vgs: 20nC @ 4.5V; Current - Continuous Drain (Id) @ 25°C: 2.4A (Ta); Rds On (Max) @ Id, Vgs: 52mOhm @ 2.4A, 4.5V; Vgs(Th) (Max) @ Id: 1.5V @ 250µA; Part Number: FDN304PZ; Supplier Part Number 1: FDN304PZCT-ND; Supplier Device Package: SuperSOT-3; ComponentLink1Description: Datasheet; ComponentLink2URL: http://digikey.com/product-detail/en/on-semiconductor/FDN304PZ/FDN304PZCT-ND/1849909; ComponentLink1URL: https://www.onsemi.com/pub/Collateral/FDN304PZ-D.pdf; Supplier 1: DigiKey; Series: PowerTrench®; Part Status: Active; ComponentLink2Description: DigiKey Link; Packaging: TapeAndReel; Minimum Order: 1; Drain To Source Voltage (Vdss): 20V; Package / Case: TO-236-3, SC-59, SOT-23-3; Lifecycle Status: Active; LastUpdated: 2023-01-02T21:05:00.863; Technology: MOSFET (Metal Oxide); Operating Temperature: -55°C ~ 150°C (TJ); Mounting Type: Surface Mount; Price: 0.18
J1D = USB4105-GF-A-060: USB Connector Type C SMT 12 Pin; Manufacturer: GCT; Manufacturer Part Number: USB4105-GF-A-060; Distributor Link: https://eu.mouser.com/ProductDetail/GCT/USB4105-GF-A-060?qs=QNEnbhJQKvY2mocwNJzgfA%3D%3D
R1D R2D = AC0402FR-075K1L: RES SMD 5.1K OHM 1% 1/16W 0402; Manufacturer: Yageo; id: 5028; Temperature Coefficient: ±100ppm/°C; Power (Watts): 0.063W, 1/16W; Part Number: AC0402FR-075K1L; Height - Seated (Max): 0.015" (0.37mm); Supplier Part Number 1: YAG3503CT-ND; Supplier Device Package: 0402; ComponentLink1Description: Datasheet; ComponentLink2URL: https://www.digikey.com/en/products/detail/yageo/AC0402FR-075K1L/5895438; Features: Automotive AEC-Q200, Moisture Resistant; ComponentLink1URL: https://www.yageo.com/upload/media/product/productsearch/datasheet/rchip/PYu-AC_51_RoHS_L_7.pdf; Composition: Thick Film; Tolerance: ±1%; Supplier 1: DigiKey; Series: AC; Part Status: Active; ComponentLink2Description: DigiKey Link; Device Package: 0402 (1005 Metric); Packaging: CutTape; Ratings: AEC-Q200; Minimum Order: 1; Package / Case: 0402 (1005 Metric); PartId: 12111; Lifecycle Status: Active; LastUpdated: 2023-01-02T20:21:09.567; Operating Temperature: -55°C ~ 155°C; Number Of Terminations: 2; Value: 5.1 kOhms; Size / Dimension: 0.039" L x 0.020" W (1.00mm x 0.50mm); Price: 0.01; Resistance: 5.1 kOhms
R3D R4D = AA0402FR-0710KL: as R1A on sheet Base IC; Part Number: AA0402FR-0710KL; Height - Seated (Max): 0.015" (0.37mm); Supplier Part Number 1: 13-AA0402FR-0710KLCT-ND; Supplier Device Package: 0402; ComponentLink1Description: Datasheet; ComponentLink2URL: https://www.digikey.com/en/products/detail/yageo/AA0402FR-0710KL/5887729; Features: Anti-Sulfur, Automotive AEC-Q200, Moisture Resistant; ComponentLink1URL: https://www.yageo.com/upload/media/product/productsearch/datasheet/rchip/PYu-AA_51_RoHS_L_3.pdf; Composition: Thick Film; Tolerance: ±1%; Supplier 1: DigiKey; Series: AA; Part Status: Active; ComponentLink2Description: DigiKey Link; Device Package: 0402 (1005 Metric); Packaging: TapeAndReel; Ratings: AEC-Q200; Minimum Order: 1; Package / Case: 0402 (1005 Metric); PartId: 59190; Lifecycle Status: Active; LastUpdated: 2023-01-02T20:20:10.303; Operating Temperature: -55°C ~ 155°C; Number Of Terminations: 2; Value: 10 kOhms; Size / Dimension: 0.039" L x 0.020" W (1.00mm x 0.50mm); Price: 0.01; Resistance: 10 kOhms
R5D = AA0402FR-071KL: as R3A on sheet Base IC; Part Number: AA0402FR-071KL; Height - Seated (Max): 0.015" (0.37mm); Supplier Part Number 1: 13-AA0402FR-071KLCT-ND; Supplier Device Package: 0402; ComponentLink1Description: Datasheet; ComponentLink2URL: https://www.digikey.com/en/products/detail/yageo/AA0402FR-071KL/5887878; Features: Anti-Sulfur, Automotive AEC-Q200, Moisture Resistant; ComponentLink1URL: https://www.yageo.com/upload/media/product/productsearch/datasheet/rchip/PYu-AA_51_RoHS_L_3.pdf; Composition: Thick Film; Tolerance: ±1%; Supplier 1: DigiKey; Series: AA; Part Status: Active; ComponentLink2Description: DigiKey Link; Device Package: 0402 (1005 Metric); Packaging: TapeAndReel; Ratings: AEC-Q200; Minimum Order: 1; Package / Case: 0402 (1005 Metric); PartId: 59178; Lifecycle Status: Active; LastUpdated: 2023-01-02T20:20:10.210; Operating Temperature: -55°C ~ 155°C; Number Of Terminations: 2; Value: 1 kOhms; Size / Dimension: 0.039" L x 0.020" W (1.00mm x 0.50mm); Price: 0.01; Resistance: 1 kOhms
R6D = AC0402FR-071ML: RES SMD 1M OHM 1% 1/16W 0402; Manufacturer: Yageo; id: 4991; Temperature Coefficient: ±100ppm/°C; Power (Watts): 0.063W, 1/16W; Part Number: AC0402FR-071ML; Height - Seated (Max): 0.015" (0.37mm); Supplier Part Number 1: YAG3450CT-ND; Supplier Device Package: 0402; ComponentLink1Description: Datasheet; ComponentLink2URL: https://www.digikey.com/en/products/detail/yageo/AC0402FR-071ML/5895164; Features: Automotive AEC-Q200, Moisture Resistant; ComponentLink1URL: https://www.yageo.com/upload/media/product/productsearch/datasheet/rchip/PYu-AC_51_RoHS_L_7.pdf; Composition: Thick Film; Tolerance: ±1%; Supplier 1: DigiKey; Series: AC; Part Status: Active; ComponentLink2Description: DigiKey Link; Device Package: 0402 (1005 Metric); Packaging: CutTape; Ratings: AEC-Q200; Minimum Order: 1; Package / Case: 0402 (1005 Metric); PartId: 12043; Lifecycle Status: Active; LastUpdated: 2023-01-02T20:21:09.883; Operating Temperature: -55°C ~ 155°C; Number Of Terminations: 2; Value: 1 MOhms; Size / Dimension: 0.039" L x 0.020" W (1.00mm x 0.50mm); Price: 0.01; Resistance: 1 MOhms
SJ1D = Rounded Jumper Joint
U1D = CMP-209535-000001-1: LDO Voltage Regulators 1A, 3.3V; Manufacturer: Advanced Monolithic Systems; Dropout Voltage: 1.1V; Output Type: Fixed; Nominal Supply Current: 5mA; Max Power Dissipation: 1.2W; Max Supply Voltage: 15V; Number Of Outputs: 1; Standoff Height: 0.64mm; Max Junction Temp: +125°C; Height: 1.8mm; Package: AMS1117; Device Class L2: Power Management ICs; ComponentLink2Description: Datasheet; ComponentLink2URL: http://www.advanced-monolithic.com/pdf/ds1117.pdf; Category: IC; RoHS: TRUE; Automotive: No; Device Class L1: Integrated Circuits (ICs); Output Current: 1A; Device Class L3: Voltage Regulators - Linear; Temperature: -40°C to +125°C; Output Voltage: 3.3V; Manufacturer Part Number: AMS1117-3.3; Temperature Range Low: -40°C; Octopart: https://octopart.com/ams1117-3.3-advanced+monolithic+systems-25899300; Lead Free: Yes; Ipc Land Pattern Name: SOT229P700X180-4; Temperature Range High: +125°C
U2D = CMP-00278-01010492-1: MC33269DTG Adjustable Positive LDO Regulator, 1.225V Min, 1.275V Max, 1.25V Dropout, BIPolar, PSSO2; Manufacturer Lifecycle Status: LAST SHIPMENTS; Min Current Limit: 800mA; Number of Channels: 1; Accuracy: 1%; Max Junction Temperature (Tj): 150°C; Nominal Supply Current: 5.5mA; Reference Voltage: 1.265V; Max Input Voltage: 20V; Max Output Voltage: 10V; Min Output Voltage: 3.3V; Dropout Voltage: 1.1V; RoHS: Compliant; Lifecycle Status: EOL; Output Voltage: 1.25V; NexarPartId: 1010492; Number of Outputs: 1; Number of Pins: 3; Output Current: 800mA; Halogen Free: Halogen Free; Lead Free: Lead Free; Width: 6.22mm; Polarity: Positive; Max Operating Temperature: 125°C; Schedule B: 8542390000, 8542390000; REACH SVHC: No SVHC; Height: 2.38mm; Mount: Surface Mount; Max Output Current: 800mA; Max Supply Voltage: 20V; Number of Regulators: 1; Case/Package: DPAK; Output Voltage Accuracy: 1%; Current Rating: 800mA; Length: 6.73mm; Output Type: Adjustable; Radiation Hardening: No; Min Operating Temperature: -40°C

## Sheet UART.SchDoc: USB to UART & DEBUG PORT
size A4; SheetNumber: 3; SheetTotal: 5; DOC_NO_SCH_DWG: #032024040602
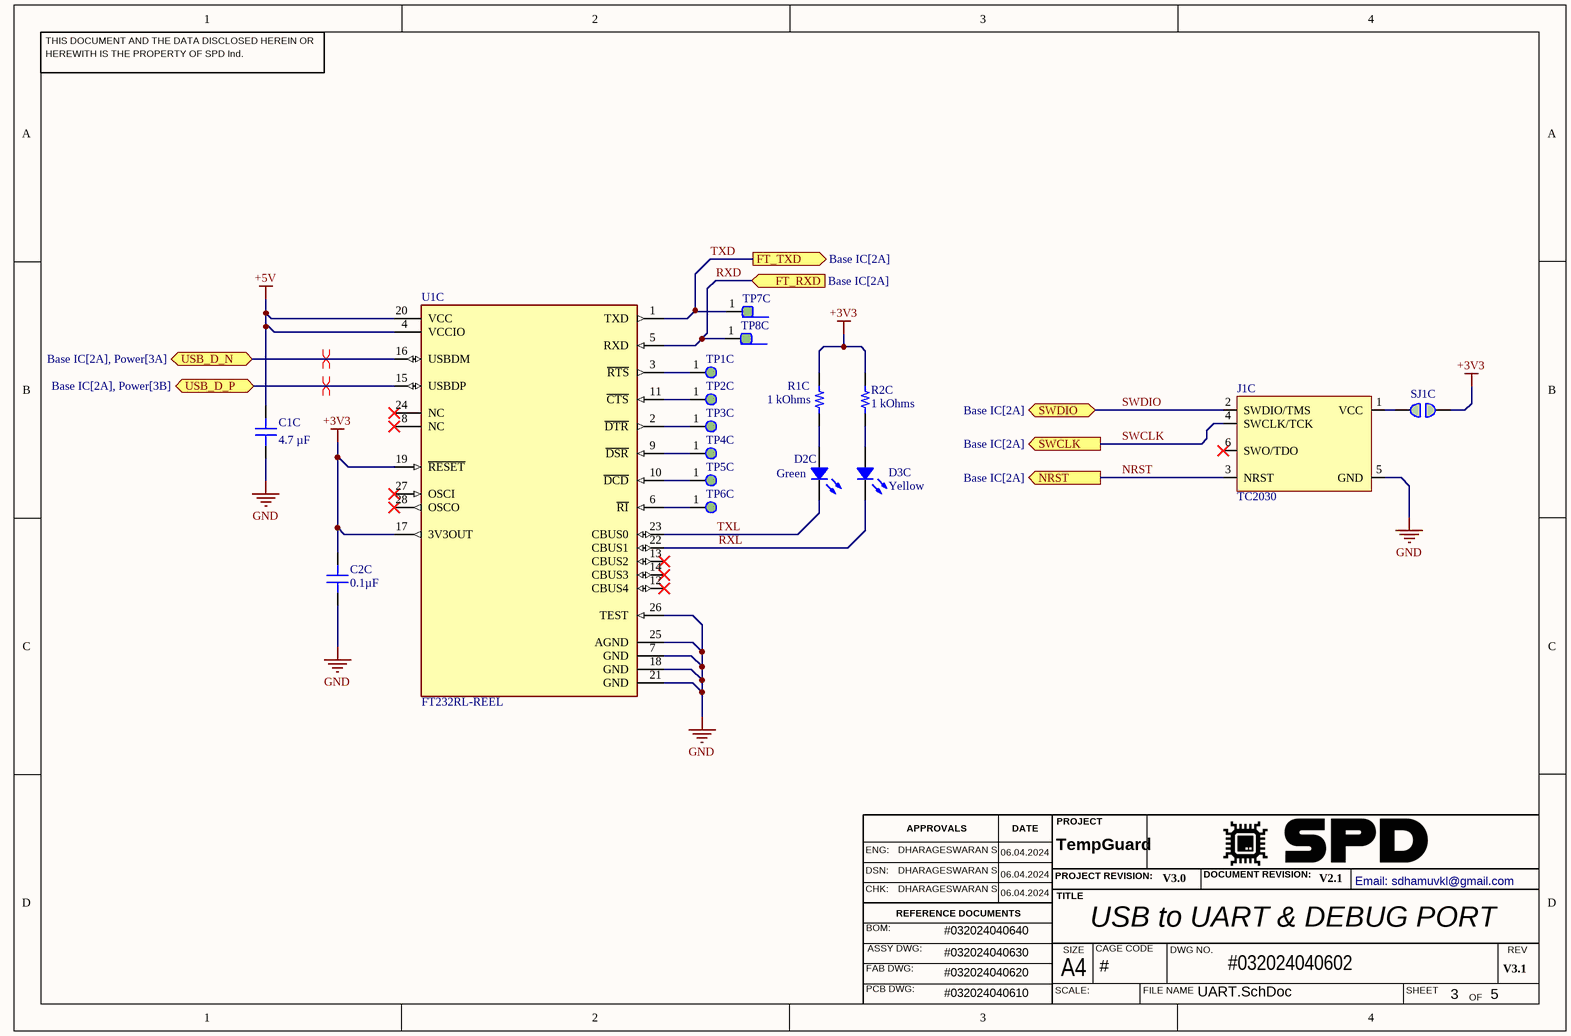
[diagram p2: UART.SchDoc]

### Parts
C1C  4.7 µF  [CAP 0603_1608]
C2C  0.1µF  [CAP 0603_1608]
D2C  Green  [LED 0603_1608 GREEN]
D3C  Yellow  [LED 0603_1608 YELLOW]
J1C  TC2030  [TC2030-FP]  (no BOM)
R1C  1 kOhms  [RES 0603_1608]
R2C  1 kOhms  [RES 0603_1608]
SJ1C  2PIN  [Rounded Jumper]  (value not drawn)
TP1C  ROUND PAD 2MM  [ROUND PAD 2MM]  (value not drawn)
TP2C  ROUND PAD 2MM  [ROUND PAD 2MM]  (value not drawn)
TP3C  ROUND PAD 2MM  [ROUND PAD 2MM]  (value not drawn)
TP4C  ROUND PAD 2MM  [ROUND PAD 2MM]  (value not drawn)
TP5C  ROUND PAD 2MM  [ROUND PAD 2MM]  (value not drawn)
TP6C  ROUND PAD 2MM  [ROUND PAD 2MM]  (value not drawn)
TP7C  SQUARE PAD 1.5MM  [SQUARE PAD 1.5MM]  (value not drawn)
TP8C  SQUARE PAD 1.5MM  [SQUARE PAD 1.5MM]  (value not drawn)
U1C  FT232RL-REEL  [FP-SSOP-28-MFG]

### Ports
FT_RXD (in, see Base IC[2A]), FT_TXD (out, see Base IC[2A]), NRST (out, see Base IC[2A]), SWCLK (out, see Base IC[2A]), SWDIO (bidir, see Base IC[2A]), USB_D_N (bidir, see Base IC[2A], Power[3A]), USB_D_P (bidir, see Base IC[2A], Power[3B])

### Nets
+3V3: C2C.2 R1C.2 R2C.2 SJ1C.2 U1C.17(3V3OUT) U1C.19(~{RESET})
+5V: C1C.2 U1C.4(VCCIO) U1C.20(VCC)
GND: C1C.1 C2C.1 J1C.5(GND) U1C.7(GND) U1C.18(GND) U1C.21(GND) U1C.25(AGND) U1C.26(TEST)
NRST: J1C.3(NRST) ; port NRST  [project net MCU_RESET]
RXD: TP8C.1 U1C.5(RXD) ; port FT_RXD  [project net MCU_TXD]
RXL: D3C.2 U1C.22(CBUS1)
SWCLK: J1C.4(SWCLK/TCK) ; port SWCLK
SWDIO: J1C.2(SWDIO/TMS) ; port SWDIO
TVS_D_N: U1C.16(USBDM) ; port USB_D_N
TVS_D_P: U1C.15(USBDP) ; port USB_D_P
TXD: TP7C.1 U1C.1(TXD) ; port FT_TXD  [project net MCU_RXD]
TXL: D2C.2 U1C.23(CBUS0)
NetD2C_1: D2C.1 R1C.1
NetD3C_1: D3C.1 R2C.1
NetJ1C_1: J1C.1(VCC) SJ1C.1
NetTP1C_1: TP1C.1 U1C.3(~{RTS})
NetTP2C_1: TP2C.1 U1C.11(~{CTS})
NetTP3C_1: TP3C.1 U1C.2(~{DTR})
NetTP4C_1: TP4C.1 U1C.9(~{DSR})
NetTP5C_1: TP5C.1 U1C.10(~{DCD})
NetTP6C_1: TP6C.1 U1C.6(~{RI})

Not connected (* = marked no-connect by the designer): J1C 6(SWO/TDO)*; U1C 8(NC)* 12(CBUS4)* 13(CBUS2)* 14(CBUS3)* 24(NC)* 27(OSCI)* 28(OSCO)*

### Layout directives
differential pair: TVS_D_N, TVS_D_P

### Notes on the sheet
- THIS DOCUMENT AND THE DATA DISCLOSED HEREIN OR
- HEREWITH IS THE PROPERTY OF SPD Ind.
- ENG:
- DHARAGESWARAN S
- APPROVALS
- DATE
- PROJECT
- DSN:
- CHK:
- REFERENCE DOCUMENTS
- PROJECT REVISION:
- TITLE
- DOCUMENT REVISION:
- Email: sdhamuvkl@gmail.com <https://github.com/DhamuVkl>
- BOM:
- FAB DWG:
- PCB DWG:
- ASSY DWG:
- SCALE:
- A4
- SIZE
- CAGE CODE
- FILE NAME
- DWG NO.
- SHEET
- REV
- OF

### Library data of the parts
C1C = GRM188C71A475KE11D: CAP CER 4.7UF 10V X7S 0603; Manufacturer: Murata Electronics; id: 84; Tolerance: ±10%; Part Number: GRM188C71A475KE11D; Value: 4.7 µF; Temperature Coefficient: X7S; Supplier Part Number 1: 490-11992-1-ND; ComponentLink2Description: DigiKey Link; ComponentLink1URL: https://search.murata.co.jp/Ceramy/image/img/A01X/G101/ENG/GRM188C71A475KE11-01.pdf; PartId: 2397; Supplier 1: DigiKey; Series: GRM; LastUpdated: 2023-01-03T20:07:47.610; Part Status: Active; Capacitance: 4.7 µF; Device Package: 0603 (1608 Metric); Thickness (Max): 0.037" (0.95mm); Voltage - Rated: 10V; Minimum Order: 1; Packaging: TapeAndReel; Applications: General Purpose; Package / Case: 0603 (1608 Metric); ComponentLink1Description: Datasheet; Price: 0.04; ComponentLink2URL: https://www.digikey.com/en/products/detail/murata-electronics/GRM188C71A475KE11D/4905309; Lifecycle Status: Active; Operating Temperature: -55°C ~ 125°C; Size / Dimension: 0.063" L x 0.031" W (1.60mm x 0.80mm); Mounting Type: Surface Mount, MLCC
C2C = LD03ZC104KAB2A: CAP CER 0.1UF 10V X7R 0603; Manufacturer: AVX Corporation; id: 3762; Tolerance: ±10%; Part Number: LD03ZC104KAB2A; Value: 0.1µF; Temperature Coefficient: X7R; Supplier Part Number 1: 478-12926-1-ND; ComponentLink2Description: DigiKey Link; ComponentLink1URL: http://datasheets.avx.com/LD-Series.pdf; PartId: 16481; Supplier 1: DigiKey; Series: LD; LastUpdated: 2020-09-02T01:03:06.140; Part Status: Active; Capacitance: 0.1µF; Device Package: 0603 (1608 Metric); Thickness (Max): 0.035" (0.90mm); Voltage - Rated: 10V; Minimum Order: 1; Packaging: TapeAndReel; Applications: General Purpose; Package / Case: 0603 (1608 Metric); ComponentLink1Description: Datasheet; Price: 0.17; ComponentLink2URL: http://digikey.com/product-detail/en/avx-corporation/LD03ZC104KAB2A/478-12926-1-ND/9949296; Lifecycle Status: Active; Operating Temperature: -55°C ~ 125°C; Size / Dimension: 0.063" L x 0.032" W (1.60mm x 0.81mm); Mounting Type: Surface Mount, MLCC
D2C = SML-LXFP0603SUGCTR: LED GREEN CLEAR SMD; Manufacturer: Lumex Opto/Components Inc.; id: 589; Lens Color: Colorless; Wavelength - Peak: 574nm; Lens Style: Rectangle with Flat Top; Viewing Angle: 130°; Lens Size: 1.60mm x 0.80mm; Configuration: Standard; Voltage - Forward (Vf) (Typ): 2V; Current - Test: 5mA; Millicandela Rating: 13mcd; Part Number: SML-LXFP0603SUGCTR; Supplier Part Number 1: 67-2222-1-ND; Lens Transparency: Clear; Supplier Device Package: SMD; ComponentLink1Description: Datasheet; Color: Green; ComponentLink2URL: https://www.digikey.com/en/products/detail/lumex-opto-components-inc/SML-LXFP0603SUGCTR/4496766; ComponentLink1URL: https://www.lumex.com/content/files/ProductAttachment/SML-LXFP0603SUGCTR.pdf; Supplier 1: DigiKey; Series: -; Height (Max): 0.20mm; Part Status: Active; ComponentLink2Description: DigiKey Link; Device Package: 0603 (1608 Metric); Packaging: TapeAndReel; Minimum Order: 1; Package / Case: 0603 (1608 Metric); PartId: 589; Lifecycle Status: Active; LastUpdated: 2023-01-02T20:56:41.527; Value: Green; Size / Dimension: 1.60mm L x 0.80mm W; Mounting Type: Surface Mount; Price: 0.07
D3C = VLMY1300-GS08: LED YELLOW 0603 SMD; Manufacturer: Vishay Semiconductor Opto Division; id: 107; Lens Color: 1.00mm; Wavelength - Peak: 588nm; Lens Style: Rectangle with Flat Top; Viewing Angle: 130°; Lens Size: 1.10mm x 0.80mm; Configuration: Standard; Wavelength - Dominant: 591nm; Voltage - Forward (Vf) (Typ): 2.1V; Current - Test: 20mA; Millicandela Rating: 104mcd; Part Number: VLMY1300-GS08; Supplier Part Number 1: VLMY1300-GS08CT-ND; Supplier Device Package: 0603; ComponentLink1Description: Datasheet; Color: Yellow; ComponentLink2URL: https://www.digikey.com/en/products/detail/vishay-semiconductor-opto-division/VLMY1300-GS08/2813349; ComponentLink1URL: http://www.vishay.com/docs/82437/vlmo1300.pdf; Supplier 1: DigiKey; Series: CHIPLED; Height (Max): 1.00mm; Part Status: Active; ComponentLink2Description: DigiKey Link; Device Package: 0603 (1608 Metric); Packaging: TapeAndReel; Minimum Order: 1; Package / Case: 0603 (1608 Metric); PartId: 107; Lifecycle Status: Active; LastUpdated: 2023-01-02T20:57:39.580; Value: Yellow; Size / Dimension: 1.60mm L x 0.80mm W; Mounting Type: Surface Mount; Price: 0.05
J1C = TC2030: Tag-Connect No-Solder SWD Debug Connector DO NOT PLACE; Manufacturer: Tag-Connect; Manufacturer Part Number: TC2030; Supplier 1: Digikey; Supplier Part Number 1: TC2030-MCP-NLTC-ND
R1C R2C = CPF0603B1K0E: RES SMD 1K OHM 0.1% 1/16W 0603; Manufacturer: TE Connectivity Passive Product; id: 16; Temperature Coefficient: ±25ppm/°C; Power (Watts): 0.063W, 1/16W; Part Number: CPF0603B1K0E; Height - Seated (Max): 0.022" (0.55mm); Supplier Part Number 1: A119887CT-ND; Supplier Device Package: 0603; ComponentLink1Description: Datasheet; ComponentLink2URL: https://www.digikey.com/en/products/detail/te-connectivity-passive-product/CPF0603B1K0E/2390473; ComponentLink1URL: https://www.te.com/commerce/DocumentDelivery/DDEController?Action=srchrtrv&DocNm=1773200&DocType=DS&DocLang=English; Composition: Thin Film; Tolerance: ±0.1%; Supplier 1: DigiKey; Series: CPF, Neohm; Part Status: Active; ComponentLink2Description: DigiKey Link; Device Package: 0603 (1608 Metric); Packaging: TapeAndReel; Minimum Order: 1; Package / Case: 0603 (1608 Metric); PartId: 4877; Lifecycle Status: Active; LastUpdated: 2023-01-02T20:30:26.897; Operating Temperature: -55°C ~ 155°C; Number Of Terminations: 2; Value: 1 kOhms; Size / Dimension: 0.061" L x 0.031" W (1.55mm x 0.80mm); Price: 0.09; Resistance: 1 kOhms
SJ1C = Rounded Jumper
U1C = CMP-0078-00029-4: IC USB FS SERIAL UART 28-SSOP; Data Rate: 12Mbps; Max Supply Voltage: 5.25V; Operating Supply Current: 15mA; Number of Channels: 1; Voltage: 5V; Min Supply Voltage: 3.3V; Radiation Hardening: No; Mount: Surface Mount; Min Operating Temperature: -40°C; Package Quantity: 2000; Number of Transceivers: 1; Width: 5.3mm; Number of Pins: 28; Height: 1.75mm; Weight: 0.080001oz; Lead Free: Lead Free; Length: 10.2mm; REACH SVHC: No SVHC; Max Operating Temperature: 85°C; Packaging: Tape and Reel; Interface: UART; Case/Package: SSOP